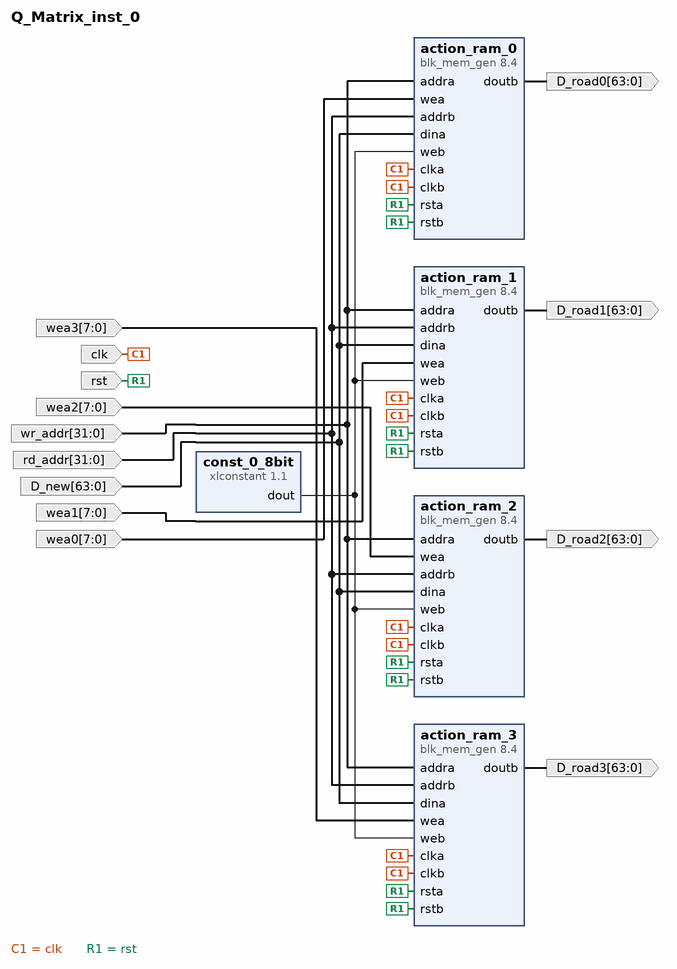
[diagram p0: block diagram of the top level]
# Vivado block design Q_Matrix_inst_0, xc7z020clg400-1, Vivado 2022.1
create_bd_design Q_Matrix_inst_0

create_bd_port -dir I -from 63 -to 0 D_new
create_bd_port -dir O -from 63 -to 0 D_road0
create_bd_port -dir O -from 63 -to 0 D_road1
create_bd_port -dir O -from 63 -to 0 D_road2
create_bd_port -dir O -from 63 -to 0 D_road3
create_bd_port -dir I -type clk clk
create_bd_port -dir I -from 31 -to 0 rd_addr
create_bd_port -dir I -type rst rst
create_bd_port -dir I -from 31 -to 0 wr_addr
create_bd_port -dir I -from 7 -to 0 wea0
create_bd_port -dir I -from 7 -to 0 wea1
create_bd_port -dir I -from 7 -to 0 wea2
create_bd_port -dir I -from 7 -to 0 wea3

create_bd_cell -type ip -vlnv xilinx.com:ip:blk_mem_gen:8.4 action_ram_0
set_property -dict [list \
  CONFIG.Assume_Synchronous_Clk true \
  CONFIG.EN_SAFETY_CKT true \
  CONFIG.Enable_32bit_Address true \
  CONFIG.Enable_A Always_Enabled \
  CONFIG.Enable_B Always_Enabled \
  CONFIG.Memory_Type True_Dual_Port_RAM \
  CONFIG.Operating_Mode_A READ_FIRST \
  CONFIG.Operating_Mode_B READ_FIRST \
  CONFIG.Port_B_Clock 100 \
  CONFIG.Port_B_Enable_Rate 100 \
  CONFIG.Port_B_Write_Rate 50 \
  CONFIG.Read_Width_A 64 \
  CONFIG.Read_Width_B 64 \
  CONFIG.Register_PortA_Output_of_Memory_Primitives false \
  CONFIG.Register_PortB_Output_of_Memory_Primitives false \
  CONFIG.Use_RSTA_Pin true \
  CONFIG.Use_RSTB_Pin true \
  CONFIG.Write_Depth_A 256 \
  CONFIG.Write_Width_A 64 \
  CONFIG.Write_Width_B 64 \
  CONFIG.use_bram_block Stand_Alone \
] [get_bd_cells action_ram_0]
create_bd_cell -type ip -vlnv xilinx.com:ip:blk_mem_gen:8.4 action_ram_1
set_property -dict [list \
  CONFIG.Assume_Synchronous_Clk true \
  CONFIG.EN_SAFETY_CKT true \
  CONFIG.Enable_32bit_Address true \
  CONFIG.Enable_A Always_Enabled \
  CONFIG.Enable_B Always_Enabled \
  CONFIG.Memory_Type True_Dual_Port_RAM \
  CONFIG.Operating_Mode_A READ_FIRST \
  CONFIG.Operating_Mode_B READ_FIRST \
  CONFIG.Port_B_Clock 100 \
  CONFIG.Port_B_Enable_Rate 100 \
  CONFIG.Port_B_Write_Rate 50 \
  CONFIG.Read_Width_A 64 \
  CONFIG.Read_Width_B 64 \
  CONFIG.Register_PortA_Output_of_Memory_Primitives false \
  CONFIG.Register_PortB_Output_of_Memory_Primitives false \
  CONFIG.Use_RSTA_Pin true \
  CONFIG.Use_RSTB_Pin true \
  CONFIG.Write_Depth_A 256 \
  CONFIG.Write_Width_A 64 \
  CONFIG.Write_Width_B 64 \
  CONFIG.use_bram_block Stand_Alone \
] [get_bd_cells action_ram_1]
create_bd_cell -type ip -vlnv xilinx.com:ip:blk_mem_gen:8.4 action_ram_2
set_property -dict [list \
  CONFIG.Assume_Synchronous_Clk true \
  CONFIG.EN_SAFETY_CKT true \
  CONFIG.Enable_32bit_Address true \
  CONFIG.Enable_A Always_Enabled \
  CONFIG.Enable_B Always_Enabled \
  CONFIG.Memory_Type True_Dual_Port_RAM \
  CONFIG.Operating_Mode_A READ_FIRST \
  CONFIG.Operating_Mode_B READ_FIRST \
  CONFIG.Port_B_Clock 100 \
  CONFIG.Port_B_Enable_Rate 100 \
  CONFIG.Port_B_Write_Rate 50 \
  CONFIG.Read_Width_A 64 \
  CONFIG.Read_Width_B 64 \
  CONFIG.Register_PortA_Output_of_Memory_Primitives false \
  CONFIG.Register_PortB_Output_of_Memory_Primitives false \
  CONFIG.Use_RSTA_Pin true \
  CONFIG.Use_RSTB_Pin true \
  CONFIG.Write_Depth_A 256 \
  CONFIG.Write_Width_A 64 \
  CONFIG.Write_Width_B 64 \
  CONFIG.use_bram_block Stand_Alone \
] [get_bd_cells action_ram_2]
create_bd_cell -type ip -vlnv xilinx.com:ip:blk_mem_gen:8.4 action_ram_3
set_property -dict [list \
  CONFIG.Assume_Synchronous_Clk true \
  CONFIG.EN_SAFETY_CKT true \
  CONFIG.Enable_32bit_Address true \
  CONFIG.Enable_A Always_Enabled \
  CONFIG.Enable_B Always_Enabled \
  CONFIG.Memory_Type True_Dual_Port_RAM \
  CONFIG.Operating_Mode_A READ_FIRST \
  CONFIG.Operating_Mode_B READ_FIRST \
  CONFIG.Port_B_Clock 100 \
  CONFIG.Port_B_Enable_Rate 100 \
  CONFIG.Port_B_Write_Rate 50 \
  CONFIG.Read_Width_A 64 \
  CONFIG.Read_Width_B 64 \
  CONFIG.Register_PortA_Output_of_Memory_Primitives false \
  CONFIG.Register_PortB_Output_of_Memory_Primitives false \
  CONFIG.Use_RSTA_Pin true \
  CONFIG.Use_RSTB_Pin true \
  CONFIG.Write_Depth_A 256 \
  CONFIG.Write_Width_A 64 \
  CONFIG.Write_Width_B 64 \
  CONFIG.use_bram_block Stand_Alone \
] [get_bd_cells action_ram_3]
create_bd_cell -type ip -vlnv xilinx.com:ip:xlconstant:1.1 const_0_8bit
set_property -dict {CONFIG.CONST_VAL 0 CONFIG.CONST_WIDTH 8} [get_bd_cells const_0_8bit]

# ---- connections ----

connect_bd_net [get_bd_pins action_ram_0/doutb] [get_bd_ports D_road0]
connect_bd_net [get_bd_pins action_ram_1/doutb] [get_bd_ports D_road1]
connect_bd_net [get_bd_pins action_ram_2/doutb] [get_bd_ports D_road2]
connect_bd_net [get_bd_pins action_ram_3/doutb] [get_bd_ports D_road3]
connect_bd_net -net addra_0_1 [get_bd_ports wr_addr] \
  [get_bd_pins action_ram_0/addra] [get_bd_pins action_ram_1/addra] [get_bd_pins action_ram_2/addra] \
  [get_bd_pins action_ram_3/addra]
connect_bd_net -net addrb_0_1 [get_bd_ports rd_addr] \
  [get_bd_pins action_ram_0/addrb] [get_bd_pins action_ram_1/addrb] [get_bd_pins action_ram_2/addrb] \
  [get_bd_pins action_ram_3/addrb]
connect_bd_net -net clka_0_1 [get_bd_ports clk] \
  [get_bd_pins action_ram_0/clka] [get_bd_pins action_ram_0/clkb] [get_bd_pins action_ram_1/clka] \
  [get_bd_pins action_ram_1/clkb] [get_bd_pins action_ram_2/clka] [get_bd_pins action_ram_2/clkb] \
  [get_bd_pins action_ram_3/clka] [get_bd_pins action_ram_3/clkb]
connect_bd_net -net const_0_4bit_dout [get_bd_pins const_0_8bit/dout] \
  [get_bd_pins action_ram_0/web] [get_bd_pins action_ram_1/web] [get_bd_pins action_ram_2/web] [get_bd_pins action_ram_3/web]
connect_bd_net -net dina_0_1 [get_bd_ports D_new] \
  [get_bd_pins action_ram_0/dina] [get_bd_pins action_ram_1/dina] [get_bd_pins action_ram_2/dina] \
  [get_bd_pins action_ram_3/dina]
connect_bd_net -net rsta_0_1 [get_bd_ports rst] \
  [get_bd_pins action_ram_0/rsta] [get_bd_pins action_ram_0/rstb] [get_bd_pins action_ram_1/rsta] \
  [get_bd_pins action_ram_1/rstb] [get_bd_pins action_ram_2/rsta] [get_bd_pins action_ram_2/rstb] \
  [get_bd_pins action_ram_3/rsta] [get_bd_pins action_ram_3/rstb]
connect_bd_net -net wea0_1 [get_bd_ports wea0] [get_bd_pins action_ram_0/wea]
connect_bd_net -net wea1_1 [get_bd_ports wea1] [get_bd_pins action_ram_1/wea]
connect_bd_net -net wea2_1 [get_bd_ports wea2] [get_bd_pins action_ram_2/wea]
connect_bd_net -net wea3_1 [get_bd_ports wea3] [get_bd_pins action_ram_3/wea]

validate_bd_design
save_bd_design
